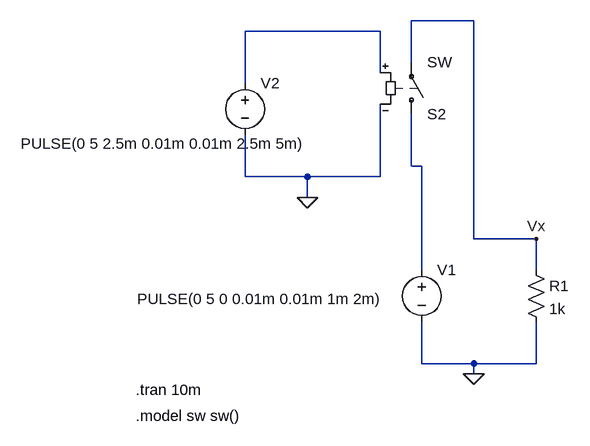
[diagram p0: schematic switch_with _pulser.asc]
switch_with _pulser.asc, the LTspice schematic file:
Version 4
SHEET 1 880 680
WIRE 112 -704 16 -704
WIRE -32 -688 -240 -688
WIRE 16 -640 16 -704
WIRE -32 -624 -32 -688
WIRE -240 -608 -240 -688
WIRE 16 -480 16 -560
WIRE 32 -480 16 -480
WIRE -240 -464 -240 -528
WIRE -144 -464 -240 -464
WIRE -32 -464 -32 -576
WIRE -32 -464 -144 -464
WIRE -144 -432 -144 -464
WIRE 112 -368 112 -704
WIRE 208 -368 112 -368
WIRE 32 -320 32 -480
WIRE 208 -320 208 -368
WIRE 32 -176 32 -240
WIRE 112 -176 32 -176
WIRE 208 -176 208 -240
WIRE 208 -176 112 -176
WIRE 112 -160 112 -176
FLAG 112 -160 0
FLAG 208 -368 Vx
FLAG -144 -432 0
SYMBOL voltage 32 -336 R0
WINDOW 3 -438 60 Left 2
WINDOW 123 0 0 Left 0
WINDOW 39 0 0 Left 0
SYMATTR InstName V1
SYMATTR Value PULSE(0 5 0 0.01m 0.01m 1m 2m)
SYMBOL res 192 -336 R0
SYMATTR InstName R1
SYMATTR Value 1k
SYMBOL voltage -240 -624 R0
WINDOW 3 -345 109 Left 2
WINDOW 123 0 0 Left 0
WINDOW 39 0 0 Left 0
SYMATTR InstName V2
SYMATTR Value PULSE(0 5 2.5m 0.01m 0.01m 2.5m 5m)
SYMBOL sw 16 -544 M180
SYMATTR InstName S2
TEXT -408 -136 Left 2 !.tran 10m
TEXT -408 -96 Left 2 !.model sw sw()

The netlist it stands for:
* switch_with _pulser.asc
V1 N002 0 PULSE(0 5 0 0.01m 0.01m 1m 2m)
R1 Vx 0 1k
V2 N001 0 PULSE(0 5 2.5m 0.01m 0.01m 2.5m 5m)
S2 N002 Vx N001 0 SW
.tran 10m
.model sw sw()
.backanno
.end